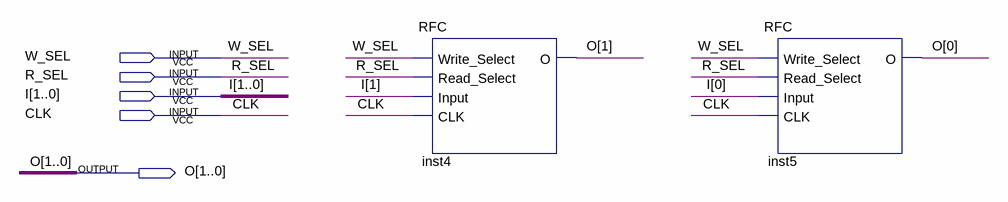
[diagram p0: schematic sheet]
// Quartus schematic RF_1x2_1O.bdf as structural Verilog: 2 symbols, 5 pins
module RF_1x2_1O (
  input  W_SEL,
  input  R_SEL,
  input  [1:0] I,
  input  CLK,
  output [1:0] O
);

  RFC inst4 (.Write_Select(W_SEL), .Read_Select(R_SEL), .Input(I[1]), .CLK(CLK), .O(O[1]));
  RFC inst5 (.Write_Select(W_SEL), .Read_Select(R_SEL), .Input(I[0]), .CLK(CLK), .O(O[0]));
endmodule
